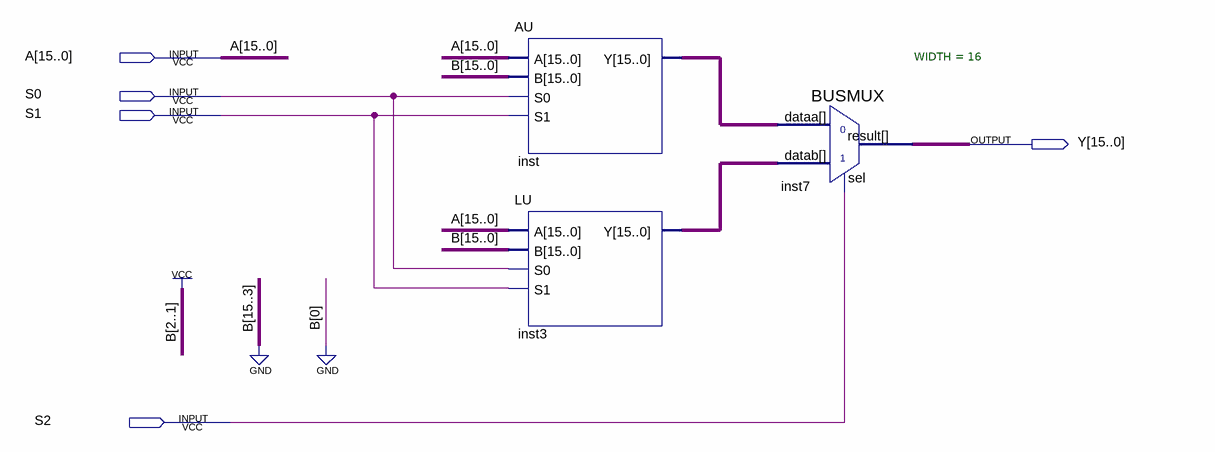
[diagram p0: schematic sheet]
// Quartus schematic Datapath.bdf as structural Verilog: 3 symbols, 5 pins
module Datapath (
  input  [15:0] A,
  input  S0,
  input  S1,
  input  S2,
  output [15:0] Y
);

  wire [15:0] inst3_y, inst_y;

  AU inst (.A(A), .B(16'b0000000000000110), .S0(S0), .S1(S1), .Y(inst_y));
  LU inst3 (.A(A), .B(16'b0000000000000110), .S0(S0), .S1(S1), .Y(inst3_y));
  BUSMUX #(.WIDTH(16)) inst7 (.datab(inst3_y), .sel(S2), .dataa(inst_y), .result(Y));
endmodule
